# Altium schematic sheet Sensor.SchDoc
size A4
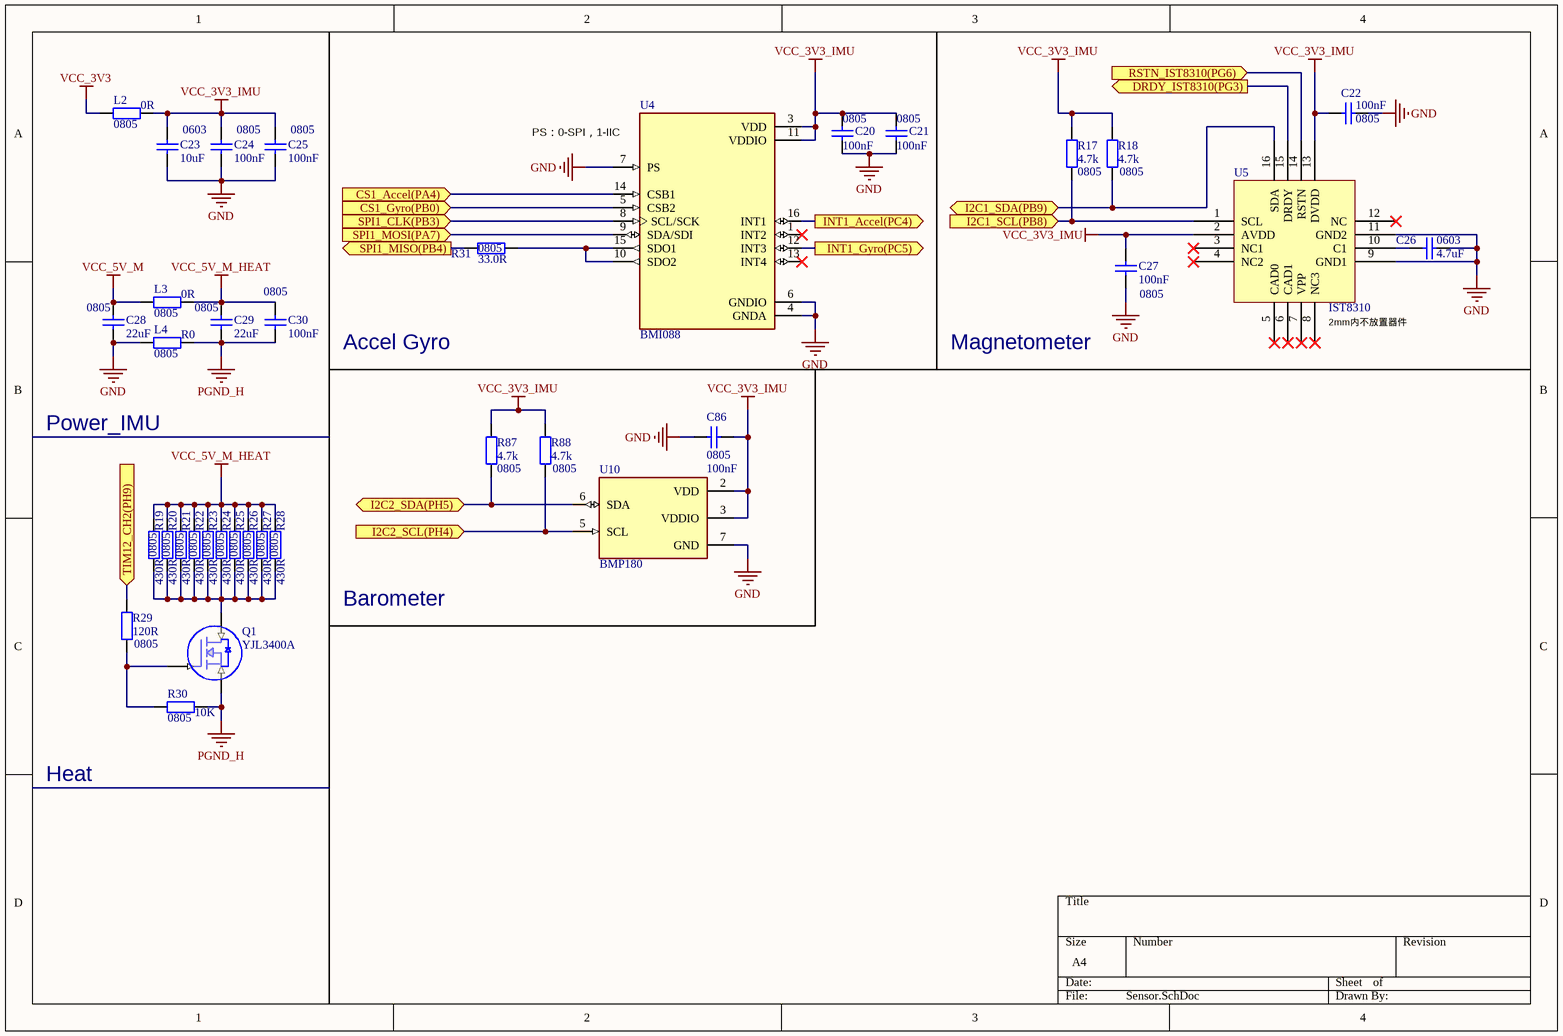
[diagram p0: Sensor.SchDoc]

## Parts
C20  0805  value 100nF  [C 0805_M]
C21  0805  value 100nF  [C 0805_M]
C22  0805  value 100nF  [C 0805_M]
C23  0603  value 10uF  [C 0603_L]
C24  0805  value 100nF  [C 0805_M]
C25  0805  value 100nF  [C 0805_M]
C26  0603  value 4.7uF  [C 0603_M]
C27  0805  value 100nF  [C 0805_M]
C28  0805  value 22uF  [C 0805_L]
C29  0805  value 22uF  [C 0805_L]
C30  0805  value 100nF  [C 0805_M]
C86  0805  value 100nF  [C 0805_M]
L2  0805  value 0R  [R 0805_L]
L3  0805  value 0R  [R 0805_L]
L4  0805  value R0  [R 0805_L]
Q1  YJL3400A  [SOT23-3M]
R17  0805  value 4.7k  [R 0805_L]
R18  0805  value 4.7k  [R 0805_L]
R19  0805  value 430R  [R 0805_L]
R20  0805  value 430R  [R 0805_L]
R21  0805  value 430R  [R 0805_L]
R22  0805  value 430R  [R 0805_L]
R23  0805  value 430R  [R 0805_L]
R24  0805  value 430R  [R 0805_L]
R25  0805  value 430R  [R 0805_L]
R26  0805  value 430R  [R 0805_L]
R27  0805  value 430R  [R 0805_L]
R28  0805  value 430R  [R 0805_L]
R29  0805  value 120R  [R 0805_L]
R30  0805  value 10K  [R 0805_L]
R31  0805  value 33.0R  [R 0805_L]
R87  0805  value 4.7k  [R 0805_L]
R88  0805  value 4.7k  [R 0805_L]
U4  BMI088  [PQFN50P450X300X100-16N]
U5  IST8310  [QFN16]
U10  BMP180  [BMP180]

## Ports
CS1_Accel(PA4) (in), CS1_Gyro(PB0) (in), DRDY_IST8310(PG3) (out), I2C1_SCL(PB8) (in), I2C1_SDA(PB9) (bidir), I2C2_SCL(PH4) (in), I2C2_SDA(PH5) (bidir), INT1_Accel(PC4) (out), INT1_Gyro(PC5) (out), RSTN_IST8310(PG6) (in), SPI1_CLK(PB3) (in), SPI1_MISO(PB4) (out), SPI1_MOSI(PA7) (in), TIM12_CH2(PH9) (in)

## Nets
GND: C20.1 C21.1 C22.2 C23.1 C24.1 C25.1 C26.2 C27.1 C28.1 C86.2 L4.1 U4.4(GNDA) U4.6(GNDIO) U4.7(PS) U5.9(GND1) U5.11(GND2) U10.7(GND)
PGND_H: C29.1 C30.1 L4.2 Q1.2(S) R30.1
VCC_3V3: L2.1
VCC_3V3_IMU: C20.2 C21.2 C22.1 C23.2 C24.2 C25.2 C27.2 C86.1 L2.2 R17.2 R18.2 R87.2 R88.2 U4.3(VDD) U4.11(VDDIO) U5.2(AVDD) U5.13(DVDD) U10.2(VDD) U10.3(VDDIO)
VCC_5V_M: C28.2 L3.1
VCC_5V_M_HEAT: C29.2 C30.2 L3.2 R19.2 R20.2 R21.2 R22.2 R23.2 R24.2 R25.2 R26.2 R27.2 R28.2
CS1_Accel(PA4): U4.14(CSB1) ; port CS1_Accel(PA4)
CS1_Gyro(PB0): U4.5(CSB2) ; port CS1_Gyro(PB0)
DRDY_IST8310(PG3): U5.15(DRDY) ; port DRDY_IST8310(PG3)
I2C1_SCL(PB8): R17.1 U5.1(SCL) ; port I2C1_SCL(PB8)
I2C1_SDA(PB9): R18.1 U5.16(SDA) ; port I2C1_SDA(PB9)
I2C2_SCL(PH4): R88.1 U10.5(SCL) ; port I2C2_SCL(PH4)
I2C2_SDA(PH5): R87.1 U10.6(SDA) ; port I2C2_SDA(PH5)
INT1_Accel(PC4): U4.16(INT1) ; port INT1_Accel(PC4)
INT1_Gyro(PC5): U4.12(INT3) ; port INT1_Gyro(PC5)
RSTN_IST8310(PG6): U5.14(RSTN) ; port RSTN_IST8310(PG6)
SPI1_CLK(PB3): U4.8(SCL/SCK) ; port SPI1_CLK(PB3)
SPI1_MISO(PB4): R31.1 ; port SPI1_MISO(PB4)
SPI1_MOSI(PA7): U4.9(SDA/SDI) ; port SPI1_MOSI(PA7)
TIM12_CH2(PH9): R29.1 ; port TIM12_CH2(PH9)
NetC26_1: C26.1 U5.10(C1)
NetQ1_1: Q1.1(G) R29.2 R30.2
NetQ1_3: Q1.3(D) R19.1 R20.1 R21.1 R22.1 R23.1 R24.1 R25.1 R26.1 R27.1 R28.1
NetR31_2: R31.2 U4.10(SDO2) U4.15(SDO1)

Not connected (* = marked no-connect by the designer): U4 1(INT2)* 13(INT4)*; U5 3(NC1)* 4(NC2)* 5(CAD0)* 6(CAD1)* 7(VPP)* 8(NC3)* 12(NC)*

## Notes on the sheet
- (near U4) PS：0-SPI，1-IIC
- Accel Gyro
- Magnetometer
- (near U5) 2mm内不放置器件
- Power_IMU
- Barometer
- Heat

## Library data of the parts
C20-C30 C86 = CAP
L2-L4 R17-R31 R87 R88 = RES2: Resistor; Published: 8-Jun-2000; LatestRevisionDate: 17-Jul-2002; LatestRevisionNote: Re-released for DXP Platform.; PackageReference: AXIAL-0.3; Publisher: Altium Limited; PackageDescription: Axial Device, Thru-Hole; 2 Leads; 0.3 in Pin Spacing
Q1 = MOSFET N
U4 = BMI088: Accelerometer, Gyroscope, 6 Axis Sensor IÂ²C, SPI Output; MF: Bosch Sensortec; Availability: Unavailable; MP: BMI088; Price: None; Value: *; SnapEDA_Link: https://www.snapeda.com/parts/BMI088/Bosch%20Sensortec/view-part/2774026/?ref=snap; Package: VFLGA-16 Bosch Sensortec
U10 = BMP180: Pressure Sensor 4.35PSI ~ 15.95PSI _30kPa ~ 110kPa_ Absolute 16 ~ 19 b 7-VLGA; MF: Bosch Sensortec; Digi-Key_Purchase_URL: https://www.digikey.com/product-detail/en/bosch-sensortec/BMP180/828-1027-1-ND/2688260?utm_source=snapeda&utm_medium=aggregator&utm_campaign=symbol; Digi-Key_Part_Number: 828-1027-1-ND; Package: VLGA-7 Bosch Sensortec; SnapEDA_Link: https://www.snapeda.com/parts/BMP180/Bosch%20Sensortec/view-part/587596/?ref=snap; Value: *; MP: BMP180